# Altium schematic sheet Sheet1.SchDoc
size A
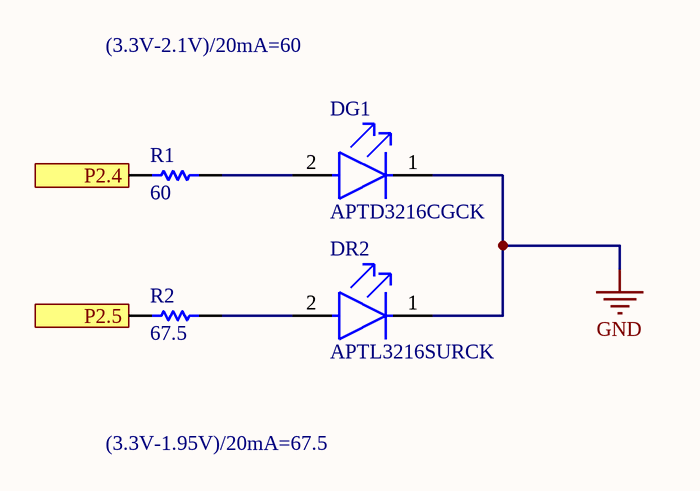
[diagram p0: Sheet1.SchDoc]

## Parts
DG1  APTD3216CGCK  [FP-APTD3216CGCK-MFG]
DR2  APTL3216SURCK  [FP-APTL3216SURCK-MFG]
R1  60  [RESC2013X70X40ML20T20]
R2  67.5  [RESC2013X70X40ML20T20]

## Ports
P2.4, P2.5

## Nets
GND: DG1.1(C) DR2.1(C)
P2.4: R1.1 ; port P2.4
P2.5: R2.1 ; port P2.5
NetDG1_2: DG1.2(A) R1.2
NetDR2_2: DR2.2(A) R2.2

## Notes on the sheet
- (3.3V-2.1V)/20mA=60
- (3.3V-1.95V)/20mA=67.5

## Library data of the parts
DG1 = CMP-44529-000049-1: LED GREEN CLEAR 2SMD; Forward Voltage: 2.1V; Forward Current: 20mA; Luminous Intensity: 300mcd; Number of LEDs: 1; Dominant Wavelength: 570nm; Viewing Angle: 50°; Lead Free: Lead Free; Lens Color: Clear; Mount: Surface Mount; Package Quantity: 2000; Height: 1.8mm; Number of Pins: 2; Test Current: 20mA; Case Code (Metric): 3216; Case/Package: 1206; Case Code (Imperial): 1206; Illumination Color: Green; Color: Green; Width: 1.6mm; Packaging: Tape and Reel; Min Operating Temperature: -40°C; Lens Style: Clear; Max Operating Temperature: 85°C; Length: 3.2mm
DR2 = CMP-44529-000007-1: LED RED CLEAR CHIP SMD; Manufacturer: Kingbright; Forward Voltage: 1.95V; Led Orientation: Top View; Peak Emmision Wavelength: 645nm; Wavelength: 630nm; Viewing Angle: 80°; Max Junction Temp: +115°C; Forward Current: 20mA; Power Dissipation: 75mW; Luminous Intensity: 550mcd; Reverse Voltage: 5V; Height: 1.2mm; Temperature: -40°C to +85°C; Device Class L3: unset; Device Class L2: LEDs; Colour: Red; ComponentLink2URL: http://www.kingbrightusa.com/images/catalog/SPEC/APTL3216SURCK.pdf; ComponentLink2Description: Datasheet; RoHS: TRUE; Lead Free: Yes; Temperature Range Low: -40°C; Temperature Range High: +85°C; Device Class L1: Optoelectronics; Mouser Description: APTL3216SURCK Red LED; 630 nm 3216 (1206); Round Lens SMD package; Package: APTL3216SURCK; Manufacturer Part Number: APTL3216SURCK; Octopart: https://octopart.com/aptl3216surck-kingbright-5355676; Digikey Description: LED RED CLEAR CHIP SMD; Automotive: No; Category: Diode
R1 R2 = CMP-2001-00270-1: Part Number: ERJ-6ENF66R5V; Manufacturer: Panasonic